# Altium schematic sheet USBdrive_charging.SchDoc
size B; SheetNumber: 2; SheetTotal: 3
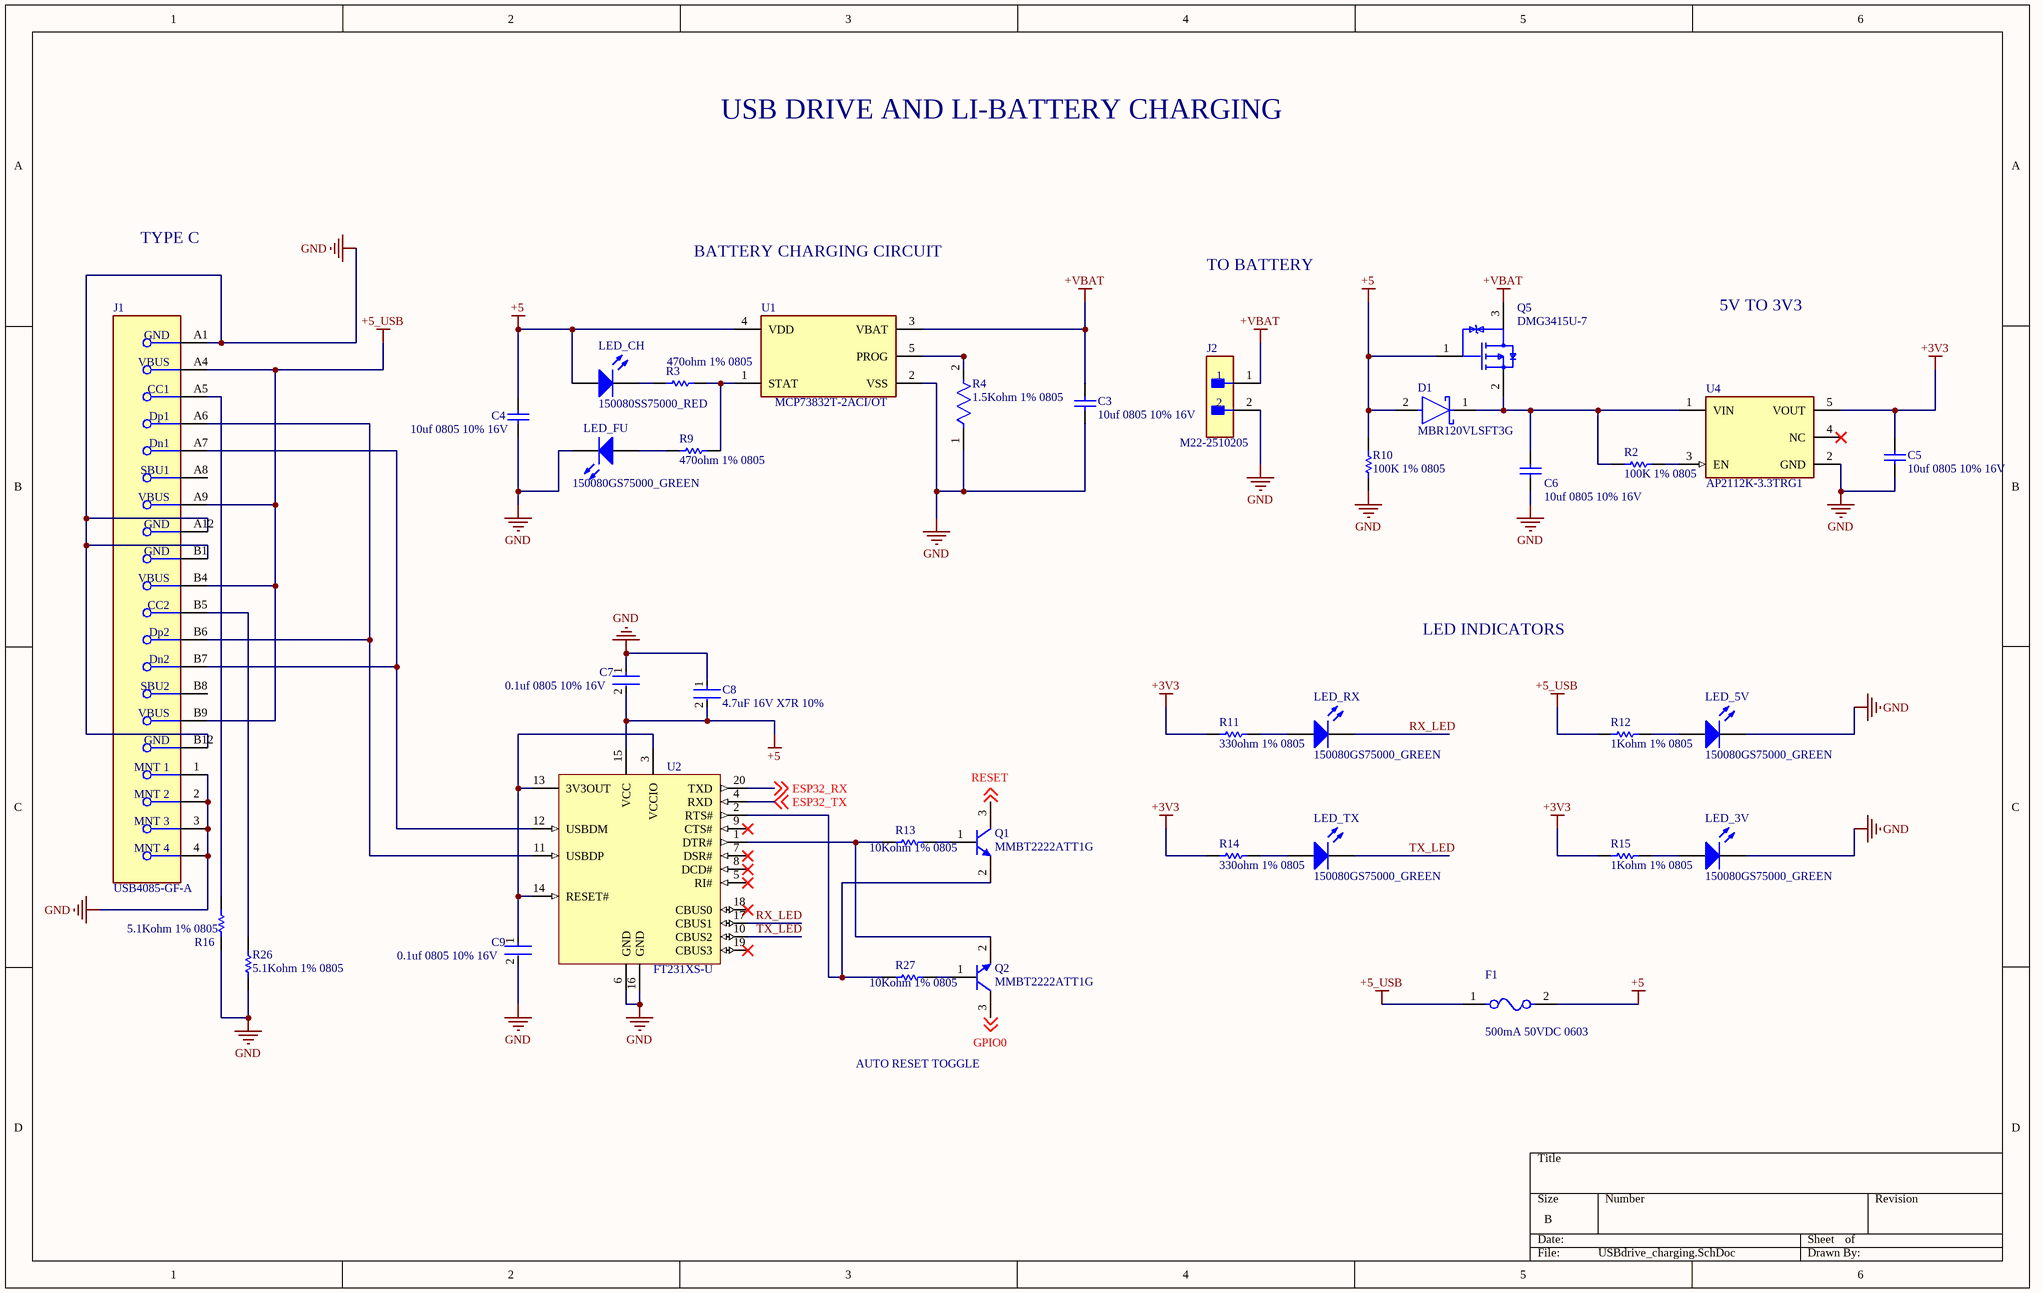
[diagram p0: USBdrive_charging.SchDoc]

## Parts
C3  10uf 0805 10% 16V  [CAPC2013X140X50ML20T25]
C4  10uf 0805 10% 16V  [CAPC2013X140X50ML20T25]
C5  10uf 0805 10% 16V  [CAPC2013X140X50ML20T25]
C6  10uf 0805 10% 16V  [CAPC2013X140X50ML20T25]
C7  0.1uf 0805 10% 16V  [FP-CC0805-0_85-MFG]
C8  4.7uF 16V X7R 10%  [FP-CGA4J-IPC_A]
C9  0.1uf 0805 10% 16V  [FP-CC0805-0_85-MFG]
D1  MBR120VLSFT3G  [FP-498-MFG]
F1  500mA 50VDC 0603  [FP-SF-0603S-MFG]
J1  USB4085-GF-A  [FP-USB4085-GF-A-MFG]
J2  M22-2510205  [FP-M22-2510205-MFG]
LED_3V  150080GS75000_GREEN  [0805_A]
LED_5V  150080GS75000_GREEN  [0805_A]
LED_CH  150080SS75000_RED  [0805_A]
LED_FU  150080GS75000_GREEN  [0805_A]
LED_RX  150080GS75000_GREEN  [0805_A]
LED_TX  150080GS75000_GREEN  [0805_A]
Q1  MMBT2222ATT1G  [ONSC-SC-75-3-463-01_V]
Q2  MMBT2222ATT1G  [ONSC-SC-75-3-463-01_V]
Q5  DMG3415U-7  [DMG3415U]
R2  100K 1% 0805  [RESC2013X60X35ML10T20]
R3  470ohm 1% 0805  [RESC2013X50X30LL20T20]
R4  1.5Kohm 1% 0805  [FP-RC2012-IPC_B]
R9  470ohm 1% 0805  [RESC2013X50X30LL20T20]
R10  100K 1% 0805  [RESC2013X60X35ML10T20]
R11  330ohm 1% 0805  [RESC2013X70X40ML20T20]
R12  1Kohm 1% 0805  [RESC2013X70X40ML20T20]
R13  10Kohm 1% 0805  [RESC2013X60X35NL10T20]
R14  330ohm 1% 0805  [RESC2013X70X40ML20T20]
R15  1Kohm 1% 0805  [RESC2013X70X40ML20T20]
R16  5.1Kohm 1% 0805  [RESC2013X50X30LL20T20]
R26  5.1Kohm 1% 0805  [RESC2013X70X40ML20T20]
R27  10Kohm 1% 0805  [RESC2013X60X35NL10T20]
U1  MCP73832T-2ACI/OT  [FP-C04-091-OT-MFG]
U2  FT231XS-U  [SSOP-20_L]
U4  AP2112K-3.3TRG1  [FP-SOT25-IPC_A]

## Nets
+3V3: C5.2 R11.1 R14.1 R15.1 U4.5(VOUT)
+5: C4.2 C7.2 C8.2 D1.2(A) F1.2 LED_CH.2(A) Q5.1(G) R10.2 U1.4(VDD) U2.15(VCC)
+5_USB: F1.1 J1.A4(VBUS) J1.A9(VBUS) J1.B4(VBUS) J1.B9(VBUS) R12.1
+VBAT: C3.2 J2.1 Q5.3(D) U1.3(VBAT)
GND: C3.1 C4.1 C5.1 C6.1 C7.1 C8.1 C9.2 J1.1(MNT_1) J1.2(MNT_2) J1.3(MNT_3) J1.4(MNT_4) J1.A1(GND) J1.A12(GND) J1.B1(GND) J1.B12(GND) J2.2 LED_3V.1(K) LED_5V.1(K) LED_FU.1(K) R4.1 R10.1 R16.1 R26.1 U1.2(VSS) U2.6(GND) U2.16(GND) U4.2(GND)
ESP32_RX: U2.20(TXD) ; off-sheet ESP32_RX
ESP32_TX: U2.4(RXD) ; off-sheet ESP32_TX
GPIO0: Q2.3(C) ; off-sheet GPIO0
RESET: Q1.3(C) ; off-sheet RESET
RX_LED: LED_RX.1(K) U2.17(CBUS1)
TX_LED: LED_TX.1(K) U2.10(CBUS2)
NetC6_2: C6.2 D1.1(C) Q5.2(S) R2.2 U4.1(VIN)
NetC9_1: C9.1 U2.3(VCCIO) U2.13(3V3OUT) U2.14(RESET#)
NetJ1_A5: J1.A5(CC1) R16.2
NetJ1_A6: J1.A6(Dp1) J1.B6(Dp2) U2.11(USBDP)
NetJ1_A7: J1.A7(Dn1) J1.B7(Dn2) U2.12(USBDM)
NetJ1_B5: J1.B5(CC2) R26.2
NetLED_3V_2: LED_3V.2(A) R15.2
NetLED_5V_2: LED_5V.2(A) R12.2
NetLED_CH_1: LED_CH.1(K) R3.1
NetLED_FU_2: LED_FU.2(A) R9.1
NetLED_RX_2: LED_RX.2(A) R11.2
NetLED_TX_2: LED_TX.2(A) R14.2
NetQ1_1: Q1.1(B) R13.2
NetQ1_2: Q1.2(E) R27.1 U2.2(RTS#)
NetQ2_1: Q2.1(B) R27.2
NetQ2_2: Q2.2(E) R13.1 U2.1(DTR#)
NetR2_1: R2.1 U4.3(EN)
NetR3_2: R3.2 R9.2 U1.1(STAT)
NetR4_2: R4.2 U1.5(PROG)

Not connected (* = marked no-connect by the designer): J1 A8(SBU1) B8(SBU2); U2 5(RI#)* 7(DSR#)* 8(DCD#)* 9(CTS#)* 18(CBUS0)* 19(CBUS3)*; U4 4(NC)*

## Notes on the sheet
- USB DRIVE AND LI-BATTERY CHARGING
- TYPE C
- BATTERY CHARGING CIRCUIT
- TO BATTERY
- 5V TO 3V3
- LED INDICATORS
- AUTO RESET TOGGLE

## Library data of the parts
C3-C6 = CMP-1036-04927-2: Part Number: 0805YD106KAT2A; Manufacturer: AVX Interconnect / Elco
C7 C9 = CMP-1036-04402-6: CAP CER 0.1UF 16V X7R 0805; Manufacturer Part Number: CC0805KRX7R7BB104; Manufacturer: Yageo; Material: Ceramic; Tolerance: 0.1; Capacitance: 100 nF; Value: 100 nF; Temperature: -30°C to +85°C; Lead Free: Yes; Footprint Url: http://www.yageo.com/exep/pages/download/literatures/UPY-C_GEN_24.pdf; Voltage Rating: 16 V; Package: CC0805-0.85; RoHS: TRUE; Digikey Description: CAP CER 0.1UF 16V X7R 0805; Category: Cap; Octopart: https://octopart.com/cc0805krx7r7bb104-yageo-39467769; Device Class L3: Ceramic Capacitors; ComponentLink2URL: http://www.yageo.com/documents/recent/UPY-GPHC_Y5V_6.3V-to-50V_8.pdf; Temperature Range Low: -30°C; Mouser Description: Multilayer Ceramic Capacitors MLCC - SMD/SMT 100nF 16V X7R 10%; Automotive: No; Device Class L2: Capacitors; Height: 0.95mm; ComponentLink2Description: Datasheet; Temperature Characteristic: X7R; Ipc Land Pattern Name: CAPC200125X85; Device Class L1: Passive Components; Temperature Range High: +85°C
C8 = CMP-08246-002090-1: Cap Ceramic 4.7uF 16V X7R 10% Pad SMD 0805 +125°C Automotive T/R; Lead Free: Lead Free; Weight: 0.000194oz; Composition: Ceramic; Tolerance: 10%; Case/Package: 0805; Min Operating Temperature: -55°C; Case Code (Metric): 2012; Mount: Surface Mount; Thickness: 0.057inch; REACH SVHC: No SVHC; Package Quantity: 1; Termination: SMD/SMT; Max Operating Temperature: 125°C; Length: 2mm; Height: 1.25mm; Width: 0.049inch; Depth: 1.25mm; Dielectric: X7R; Ratings: AEC-Q200; Case Code (Imperial): 0805; Packaging: Tape and Reel; Capacitance: 4.7uF; Radiation Hardening: No; Voltage Rating (DC): 16V; Voltage Rating: 16V
D1 = CMP-1055-00447-2: DIODE SCHOTTKY 20V 1A SOD123FL; Peak Reverse Current: 600uA; Peak Non-Repetitive Surge Current: 45A; Forward Voltage: 340mV; Polarity: Standard; Element Configuration: Single; Max Repetitive Reverse Voltage (Vrrm): 20V; Max Operating Temperature: 125°C; Forward Current: 1A; Average Rectified Current: 1A; Package Quantity: 10000; Current Rating: 1A; Max Reverse Leakage Current: 600uA; Max Surge Current: 45A; Radiation Hardening: No; Min Operating Temperature: -65°C; Max Reverse Voltage (DC): 20V; Number of Pins: 2; Output Current: 1A; Halogen Free: Halogen Free; Packaging: Tape and Reel; Max Forward Surge Current (Ifsm): 45A; REACH SVHC: No SVHC; Voltage Rating (DC): 20V; Lead Free: Lead Free
F1 = CMP-07399-000004-1: FUSE BOARD MNT 500MA 50VDC 0603; Manufacturer: Bourns Inc.; Manufacturer Part Number: SF-0603S050-2; Fuse I2T: 0.009A2Sec; Fuse Current: 0.5A; Fuse Interrupt Ac Current: 50A; Max Fuse Ac Voltage: 35V; Resistance: 232mΩ; Fuse Blow Speed: Slow; Value: 232mΩ; Max Fuse Dc Voltage: 50V; Automotive: No; Category: Fuse; Temperature Range High: +105°C; Device Class L1: Circuit Protection; Height: 0.55mm; RoHS: TRUE; ComponentLink2URL: https://www.bourns.com/docs/product-datasheets/sf0603s.pdf; Ipc Land Pattern Name: CAPC16080X45; Temperature Range Low: -20°C; Mouser Description: Surface Mount Fuses 0.50A Slow Blow SinglFuse; Package: SF-0603S; Device Class L3: unset; Digikey Description: FUSE BOARD MNT 500MA 50VDC 0603; Device Class L2: Fuses; Lead Free: Yes; Temperature: -20°C to +105°C; ComponentLink2Description: Datasheet; Octopart: https://octopart.com/sf-0603s050-2-bourns-10486821; Fuse Interrupt Dc Current: 50A
J1 = CMP-196119-000001-1: CONN RCPT USB2.0 TYPEC 16POS; Manufacturer: Global Connector Technology; Voltage Rating: 20V; Conn Orientation: Right Angle; Shielding: true; Current Rating: 4.25A; Number Of Contacts: 16; Pitch: 0.85mm; Is Female: yes; ComponentLink2URL: https://gct.co/files/drawings/usb4085.pdf; Category: Conn; Automotive: No; ComponentLink2Description: Datasheet; Height: 3.66mm; Manufacturer Part Number: USB4085-GF-A; Package: 0; Usb Standard: USB 2.0; Octopart: https://octopart.com/usb4085-gf-a-global+connector+technology-94773699; Device Class L3: unset; Digikey Description: CONN RCPT USB2.0 TYPEC 16POS; Temperature Range Low: -40°C; Temperature: -40°C to +85°C; Lead Free: Yes; Contact Material: Gold,Nickel; Device Class L1: Connectors; Temperature Range High: +85°C; Device Class L2: USB Connectors; RoHS: TRUE
J2 = CMP-15831-000005-1: CONN HEADER VERT 2POS 2MM; Manufacturer: Harwin; Conn Gender: Male; Current Rating: 2A; Number Of Contacts: 2; Conn Orientation: Vertical; Temperature Range Low: -40°C; Device Class L1: Connectors; ComponentLink2URL: https://cdn.harwin.com/pdfs/C018XX_M22_Series_Connectors.pdf; Temperature Range High: +105°C; Pitch: 2mm; Number Of Rows: 1; Temperature: -40°C to +105°C; Automotive: No; Device Class L3: unset; Octopart: https://octopart.com/m22-2510205-harwin-2538221; Mouser Description: Headers & Wire Housings 2 PIN SIL VERTICAL GOLD PIN HEADER; Height: 5.45mm; Category: Conn; Digikey Description: CONN HEADER VERT 2POS 2MM; Contact Material: Gold,Nickel; Lead Free: Yes; ComponentLink2Description: Datasheet; Manufacturer Part Number: M22-2510205; Device Class L2: Headers and Wire Housings; Package: 0; Footprint Url: https://cdn.harwin.com/pdfs/M22-251.pdf; RoHS: TRUE
LED_3V LED_5V LED_FU LED_RX LED_TX = CMP-1426-00007-1: SMD mono-color Chip LED, WL-SMCW, Green; Manufacturer: Wuerth Elektronik; PackageReference: 0805_A; Color: Green; PartNumber: 150080GS75000; ComponentLink2URL: http://katalog.we-online.com/led/datasheet/150080GS75000.pdf; ComponentLink1URL: http://www.we-online.com; ComponentLink1Description: Manufacturer URL; ComponentLink2Description: Datasheet
LED_CH = CMP-1426-00010-1: SMD mono-color Chip LED, WL-SMCW, Super Red; Manufacturer: Wuerth Elektronik; PackageReference: 0805_A; ComponentLink2URL: http://katalog.we-online.com/led/datasheet/150080SS75000.pdf; ComponentLink1URL: http://www.we-online.com; Color: Super Red; ComponentLink2Description: Datasheet; ComponentLink1Description: Manufacturer URL; PartNumber: 150080SS75000
Q1 Q2 = CMP-1048-00417-1: General Purpose Transistor, NPN Silicon, 3-Pin SC-75, Pb-Free, Tape and Reel; Manufacturer: On Semiconductor; IC Continuous (A): 0.6; fT Min (MHz): 300; DatasheetVersion: Rev. 5; PackageVersion: Rev. F, 07/2005; ComponentLink1Description: Manufacturer URL; RoHS: TRUE; Packing: Tape and Reel; ComponentLink3URL: http://www.onsemi.com/pub_link/Collateral/463-01.PDF; ComponentLink1URL: http://www.onsemi.com/; ComponentLink3Description: Package Specification; ComponentLink2URL: http://www.onsemi.cn/pub_link/Collateral/MMBT2222ATT1-D.PDF; Mounting Technology: Surface Mount; PartNumber: MMBT2222ATT1G; ComponentLink2Description: Datasheet; Polarity: NPN; PackageReference: SC-75-3-463-01; PackageDescription: 3-Pin Small Outline Transistor, Body 1.6 x 0.8 mm, Pitch 0.5 mm
Q5 = DMG3415U-7: MOSFET P-CH 20V 4A SOT-23; Manufacturer: Diodes; Rise Time: 117ns; Gate to Source Voltage (Vgs): 8V; Fall Time: 393ns; Turn-Off Delay Time: 795ns; Turn-On Delay Time: 71ns; Rds On Max: 39mR; Input Capacitance: 294pF; Max Power Dissipation: 900mW; Number of Elements: 1; Drain to Source Resistance: 42.5mR; Element Configuration: Single; Drain to Source Breakdown Voltage: -20V; Nominal Vgs: -550mV; Polarity: P-CHANNEL; Supplier 1: Digi-Key; Manufacturer Part Number: DMG3415U-7; RoHS: Yes; Category: MOSFETs; Stock 1: 24000; Pricing 1: 1=0.43000, 10=0.30500, 25=0.29160, 100=0.15370, 500=0.13620, 1000=0.10600 (USD); Mount: Surface Mount; Case/Package: SOT-23; Number of Pins: 3; Weight: 0.000282oz; Contact Plating: Tin,Matte; Min Operating Temperature: -55°C; Max Operating Temperature: 150°C; Continuous Drain Current (ID): 4A; Packaging: Tape and Reel; Drain to Source Voltage (Vdss): 20V; Package Quantity: 3000; Number of Channels: 1; Power Dissipation: 900mW; On-State Resistance: 42.5mR; Threshold Voltage: -550mV; Series: -; Drain-source On Resistance-Max: 42.5mR; Length: 2.9mm; Width: 1.3mm; Height: 1mm; Radiation Hardening: No; REACH SVHC: No SVHC; Lead Free: Lead Free; RoHS Compliant: Yes; ComponentLink1URL: https://datasheet.ciiva.com/11174/ds31735-11174977.pdf?src-supplier=Avnet; ComponentLink1Description: https://datasheet.ciiva.com/11174/ds31735-11174977.pdf?src-supplier=Avnet; ComponentLink2URL: https://datasheet.ciiva.com/13061/ds31735-64958-13061831.pdf?src-supplier=Mouser; ComponentLink2Description: https://datasheet.ciiva.com/13061/ds31735-64958-13061831.pdf?src-supplier=Mouser; ComponentLink3URL: https://datasheet.ciiva.com/935/ds31735-935015.pdf?src-supplier=Digi-Key; ComponentLink3Description: https://datasheet.ciiva.com/935/ds31735-935015.pdf?src-supplier=Digi-Key; ComponentLink4URL: https://datasheet.ciiva.com/8023/ds31735-8023980.pdf?src-supplier=Element14; ComponentLink4Description: https://datasheet.ciiva.com/8023/ds31735-8023980.pdf?src-supplier=Element14; ComponentLink5URL: https://datasheet.ciiva.com/8115/ds31735-8115357.pdf?src-supplier=Avnet; ComponentLink5Description: https://datasheet.ciiva.com/8115/ds31735-8115357.pdf?src-supplier=Avnet; ComponentLink6URL: https://datasheet.ciiva.com/16387/ds31735-16387485.pdf?src-supplier=Future+Electronics; ComponentLink6Description: https://datasheet.ciiva.com/16387/ds31735-16387485.pdf?src-supplier=Future+Electronics; ComponentLink7URL: https://datasheet.ciiva.com/935/ds31735-935013.pdf?src-supplier=Digi-Key; ComponentLink7Description: https://datasheet.ciiva.com/935/ds31735-935013.pdf?src-supplier=Digi-Key; ComponentLink8URL: https://datasheet.ciiva.com/935/ds31735-935014.pdf?src-supplier=Digi-Key; ComponentLink8Description: https://datasheet.ciiva.com/935/ds31735-935014.pdf?src-supplier=Digi-Key; ComponentLink9URL: https://datasheet.ciiva.com/22712/1915618-22712394.pdf?src-supplier=Element14; ComponentLink9Description: https://datasheet.ciiva.com/22712/1915618-22712394.pdf?src-supplier=Element14; Supplier Part Number 1: DMG3415UDICT-ND
R2 R10 = CMP-2100-03668-1: Chip Resistor, 100 KOhm, +/- 1%, 0.125 W, -55 to 155 degC, 0805 (2012 Metric), RoHS, Tape and Reel; Manufacturer: Yageo; Max Power Dissipation: 125mW; Voltage Rating: 150V; Temperature Coefficient: 100ppm/degreesC; Manufacturer URL: http://www.yageo.com/; Min Operating Temperature: -55degC; Lead Pitch: 0.4mm; Composition: ThickFilm; Case Code (Metric): 2012; Military Standard: Not; Package Description: 2-Pin Surface Mounted Device, Body 2 x 1.25 mm; REACH SVHC: Unknown; RoHSCompliant: true; Depth: 1.25mm; Number of Pins: 2; Lead Free: LeadFree; Resistance: 100KOhm; Datasheet URL: http://www.yageo.com/NewPortal/yageodocoutput?fileName=/pdf/R-Chip/PYu-RC_Group_51_RoHS_L_5.pdf; Max Operating Temperature: 155degC; Case/Package: 0805; Package Quantity: 1; Case Code (Imperial): 0805; Power Rating: 125mW; Width: 0.049inch; Package Reference: 0805; Height: 0.024inch; Termination: SMD/SMT; Tolerance: 1%; Datasheet Version: Rev. 5, 10/2016; Length: 2mm; Voltage Rating (DC): 150V; Number of Terminations: 2; Packaging: TapeandReel
R3 R9 R16 = CMP-2001-03932-1: Manufacturer: Vishay Dale; Part Number: CRCW0805470RFKEA
R4 = CMP-13261-002474-1: Res Thick Film 0805 1.5kΩ 1% 0.125W ±100ppm/°C Molded SMD T/R; Resistance: 1.5kR; Voltage Rating (DC): 150V; Max Power Dissipation: 125mW; Case Code (Metric): 2012; Packaging: Tape and Reel; Features: Moisture Resistant; Temperature Coefficient: 100ppm/°C; Case Code (Imperial): 0805; Min Operating Temperature: -55°C; Contact Plating: Tin; Tolerance: 1%; Composition: Thick Film; Height: 0.024inch; Lead Free: Lead Free; Max Operating Temperature: 155°C; Length: 0.079inch; Radiation Hardening: No; Case/Package: 0805; Width: 0.049inch; Number of Terminations: 2
R11 R14 = CMP-2001-00532-1: Manufacturer: Panasonic; Part Number: ERJ6ENF3300V
R12 R15 = CMP-2001-04375-5: Chip Resistor, 1 KOhm, +/- 1%, 0.125 W, -55 to 155 degC, 0805 (2012 Metric), RoHS, Tape and Reel; Manufacturer: Panasonic; Voltage Rating: 150 V; ComponentLink1URL: http://www.panasonic.com/; ComponentLink2Description: Datasheet; REACH SVHC: Yes; ComponentLink1Description: Manufacturer URL; Length: 2 mm; Height: 0.6 mm; Package Quantity: 1; PackageDescription: 2-Pin Surface Mount Device, Body 2 x 1.25 mm; Packaging: Cut Tape; PackageReference: 0805; Max Operating Temperature: 155 degC; Mounting Technology: Surface Mount; ComponentLink2URL: http://industrial.panasonic.com/cdbs/www-data/pdf/RDA0000/AOA0000C86.pdf; DatasheetVersion: 04/2015; Min Operating Temperature: -55 degC; RoHSCompliant: true; Mount: Surface Mount
R13 R27 = CMP-1659-00013-4: Chip Resistor, 10 KOhm, +/- 1%, 0.125 W, -55 to 155 degC, 0805 (2012 Metric), RoHS, Tape and Reel; Manufacturer: Yageo; Voltage Rating: 150 V; Mount: Surface Mount; ComponentLink1Description: Manufacturer URL; ComponentLink2URL: http://www.yageo.com/documents/recent/PYu-RC_Group_51_RoHS_L_04.pdf; Pins: 2; Length: 2 mm; Min Operating Temperature: -55 degC; Height: 0.5 mm; Mounting Technology: Surface Mount; RoHSCompliant: true; REACH SVHC: No SVHC; ComponentLink1URL: http://www.yageo.com/; Max Operating Temperature: 155 degC; PackageReference: 0805; DatasheetVersion: Rev. 4, 02/2016; Package Quantity: 5000; Packaging: Tape and Reel; ComponentLink2Description: Datasheet; PackageDescription: 2-Pin Surface Mounted Device, Body 2 x 1.25 mm
R26 = CMP-2001-00553-1: Part Number: ERJ6ENF5101V; Manufacturer: Panasonic
U1 = CMP-0133-00138-2: IC LI-ION/LI-POLY CTRLR SOT23-5; Output Current: 10mA; Output Voltage: 4.2V; Max Output Current: 500mA; Max Power Dissipation: 1.54W; Min Output Voltage: 4.168V; Number of Channels: 1; Max Supply Voltage: 6V; Min Supply Voltage: 3.75V; Max Output Voltage: 4.5V; Case/Package: SOT-23; Lead Free: Lead Free; Termination: SMD/SMT; Min Operating Temperature: -40°C; Max Operating Temperature: 85°C; Height: 1.3mm; Length: 3.1mm; Mount: Surface Mount; Package Quantity: 3000; Number of Pins: 5; Packaging: Tape and Reel; REACH SVHC: No SVHC; Contact Plating: Tin; Width: 1.8mm; Number of Cells: 1; Number of Outputs: 1; Power Dissipation: 1.54W; Max Charge Current: 500mA; Max Input Voltage: 6V; Radiation Hardening: No
U2 = CMP-0248-00015-2: USB to Full-Handshake UART Interface Chip, UHCI/OHCI/EHCI Compatible, USB 2.0 Compatible, -40 to +85 degC, 20-Pin SSOP, Pb-Free, Tube; Manufacturer: FTDI; PackageDescription: 20-Pin Small Outline Package, 8.6 x 3.9 mm Body, 0.635 mm Pitch; ComponentLink2Description: Datasheet; DatasheetVersion: ver 1.2, Feb-2013; PackageReference: SSOP-20; ComponentLink3URL: www.ftdichip.com/Products/ICs/FT231X.html; ComponentLink2URL: http://www.ftdichip.com/Support/Documents/DataSheets/ICs/DS_FT231X.pdf; PartNumber: FT231XS-U; ComponentLink3Description: FT231X Product Page; ComponentLink1URL: http://www.ftdichip.com/; Code_JEDEC: MO-137-AD; ComponentLink1Description: Manufacturer URL; RevisionNote: DatasheetVersion updated to 1.2 Feb-2013; PackageVersion: Feb-13
U4 = CMP-12756-000035-1: IC REG LINEAR 3.3V 600MA SOT25; Number of Regulators: 1; Output Type: Fixed; Polarity: Positive; Min Input Voltage: 2.5V; Max Input Voltage: 6V; Accuracy: 1.5%; Quiescent Current: 55uA; Dropout Voltage: 250mV; Min Operating Temperature: -40°C; Length: 3.1mm; Output Current: 600mA; Max Operating Temperature: 85°C; Package Quantity: 1; Output Voltage: 3.3V; Width: 1.7mm; Number of Outputs: 1; Packaging: Tape and Reel; Height: 1.3mm; Lead Free: Lead Free; Max Output Current: 600mA; Case/Package: SOT-23-5; Mount: Surface Mount; Number of Pins: 5